# EAGLE design freq_meter_low (EAGLE 6.5.0)
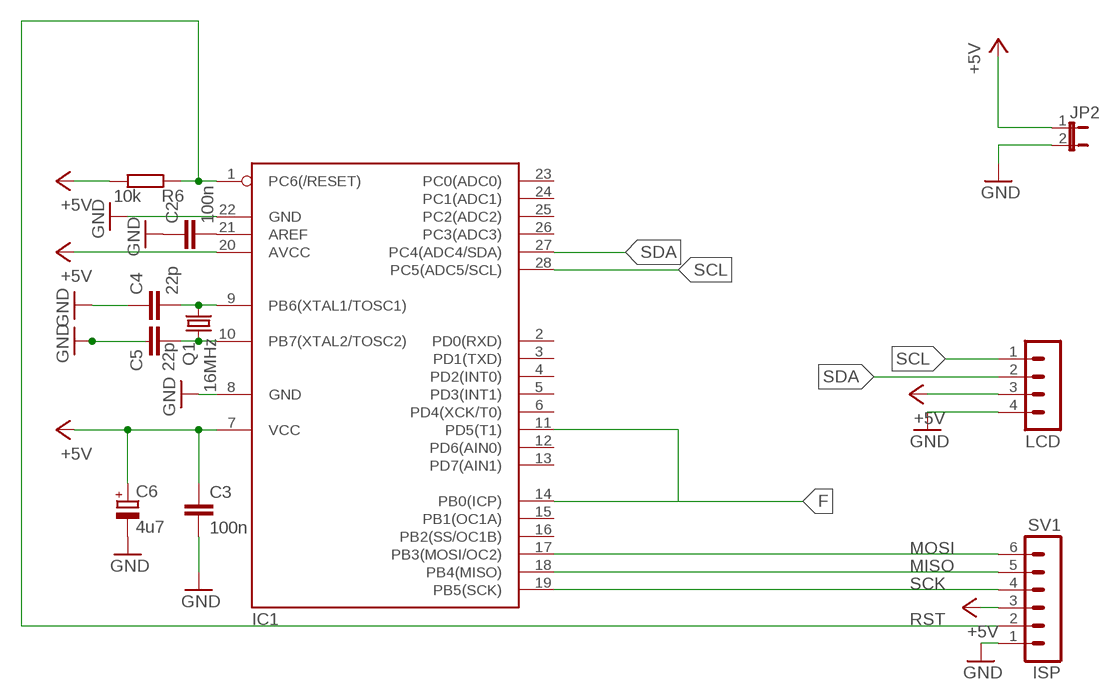
[diagram p0: schematic, sheet 1]

## Parts
C2  100n  C-EU025-024X044  [C025-024X044]
C3  100n  C-EU025-024X044  [C025-024X044]
C4  22p  C-EU025-024X044  [C025-024X044]
C5  22p  C-EU050-025X075  [C050-025X075]
C6  4u7  CPOL-EUTT2D5  [TT2D5]
IC1  MEGA8-P  [DIL28-3]
JP2  JP1E  [JP1]
LCD  MA04-1  [MA04-1]
Q1  16MHz  CRYSTALTC26V  [TC26V]
R6  10k  R-EU_0204/5  [0204/5]
SV1  ISP  MA06-1  [MA06-1]

## Nets
+5V: C3.1 C6.+ IC1.7(VCC) IC1.20(AVCC) JP2.1 LCD.3 R6.1 SV1.3
F: IC1.11(PD5(T1)) IC1.14(PB0(ICP))
GND: C2.1 C3.2 C4.1 C5.1 C6.- IC1.8(GND) IC1.22(GND) JP2.2 LCD.4 SV1.1
MISO: IC1.18(PB4(MISO)) SV1.5
MOSI: IC1.17(PB3(MOSI/OC2)) SV1.6
N$1: C2.2 IC1.21(AREF)
N$22: C4.2 IC1.9(PB6(XTAL1/TOSC1)) Q1.2
N$23: C5.2 IC1.10(PB7(XTAL2/TOSC2)) Q1.1
RST: IC1.1(PC6(/RESET)) R6.2 SV1.2
SCK: IC1.19(PB5(SCK)) SV1.4
SCL: IC1.28(PC5(ADC5/SCL)) LCD.1
SDA: IC1.27(PC4(ADC4/SDA)) LCD.2
Unconnected: IC1.2(PD0(RXD)) IC1.3(PD1(TXD)) IC1.4(PD2(INT0)) IC1.5(PD3(INT1)) IC1.6(PD4(XCK/T0)) IC1.12(PD6(AIN0)) IC1.13(PD7(AIN1)) IC1.15(PB1(OC1A)) IC1.16(PB2(SS/OC1B)) IC1.23(PC0(ADC0)) IC1.24(PC1(ADC1)) IC1.25(PC2(ADC2)) IC1.26(PC3(ADC3))

## Library data of the parts
C2-C5 = rcl:C-EU: CAPACITOR, European symbol
C6 = rcl:CPOL-EU: POLARIZED CAPACITOR, European symbol
IC1 = atmel:MEGA8-P: MICROCONTROLLER 8 Kbytes FLASH, 1 kbytes SRAM, 512 bytes EEPROM, USART, 4-channel 10 bit ADC, 2-channel 8 bit ADC Pin compatible with Atmega48, ATMega88, ATMega168 Source: avr.lbr
JP2 = jumper:JP1E: JUMPER
LCD = con-lstb:MA04-1: PIN HEADER; OC_FARNELL: unknown; OC_NEWARK: unknown
Q1 = crystal:CRYSTAL: CRYSTAL
R6 = rcl:R-EU_: RESISTOR, European symbol
SV1 = con-lstb:MA06-1: PIN HEADER; OC_FARNELL: unknown; OC_NEWARK: unknown

## Board
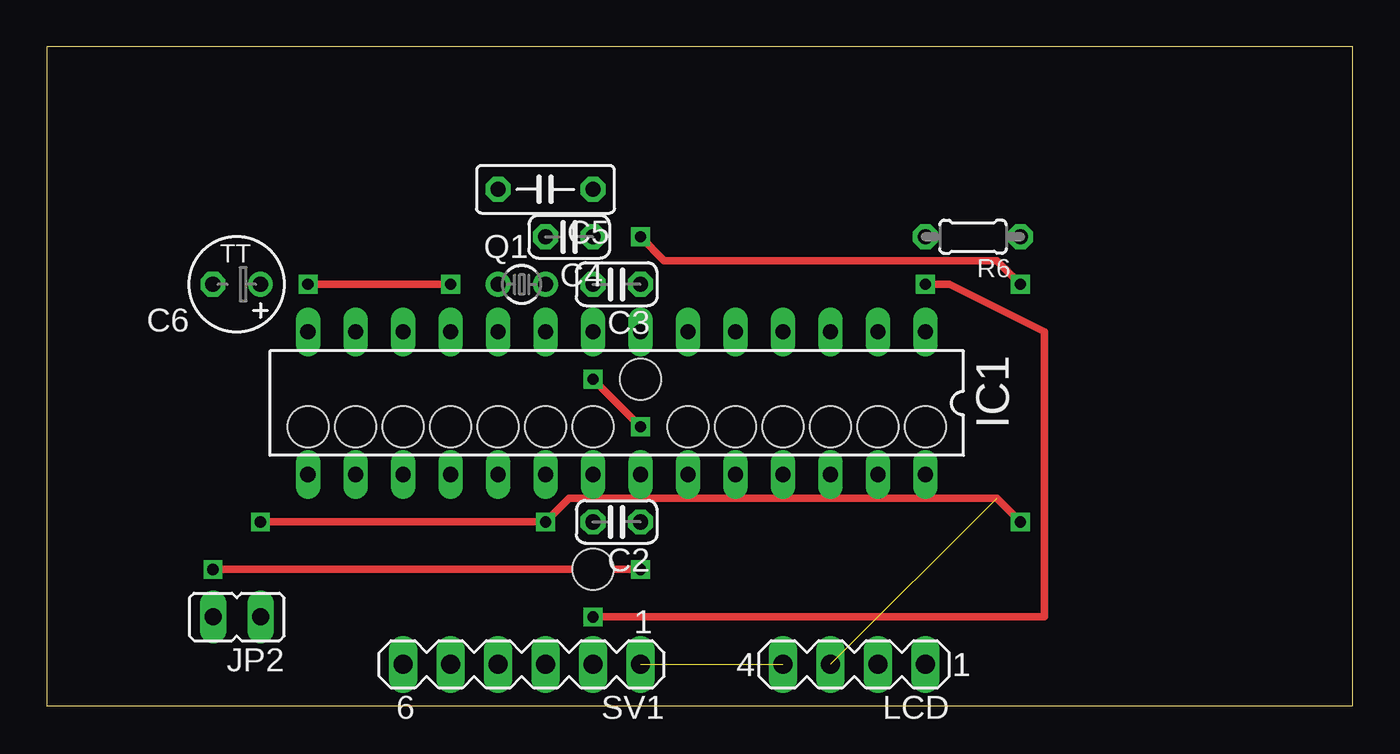
[diagram p1: board, top side]
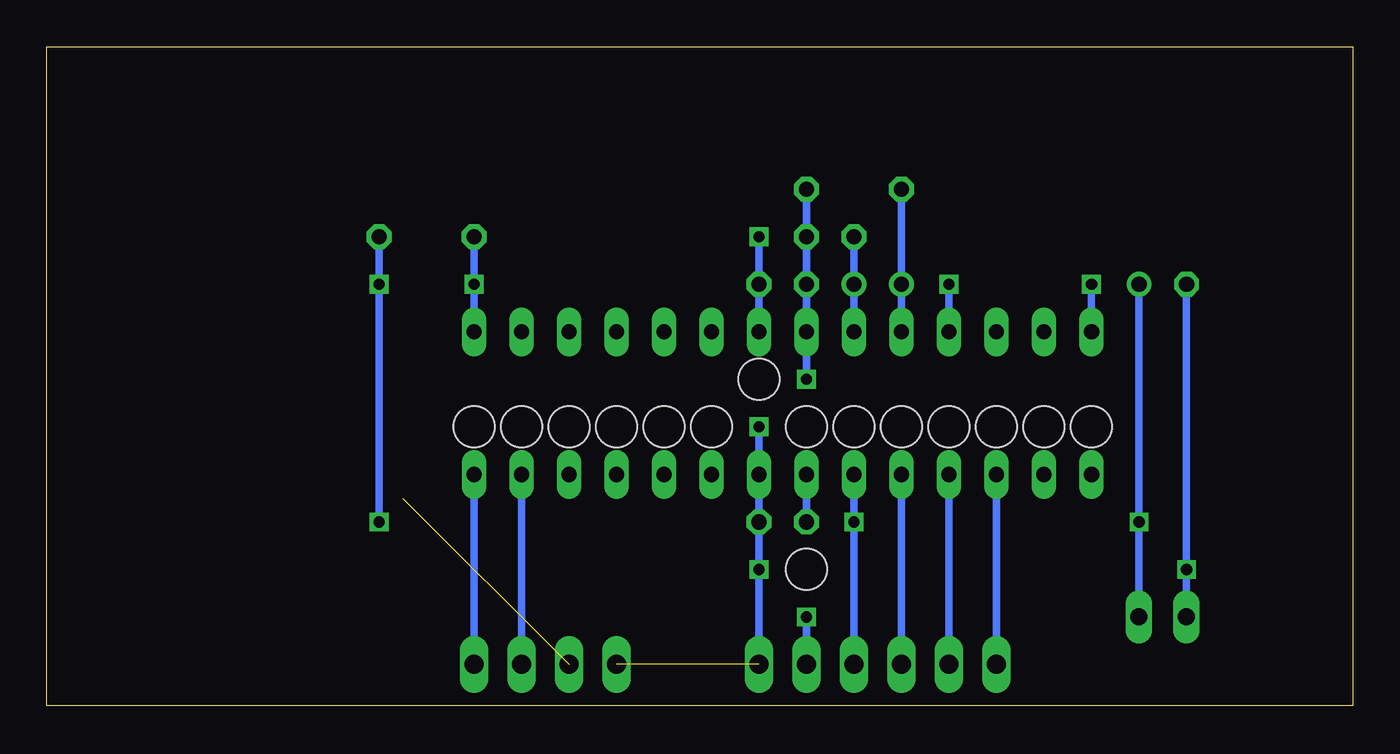
[diagram p2: board, bottom side, seen from below]

Size 69.84 x 35.23 mm. Coordinates in mm from the lower left corner, seen from the top.
Outline: 0,35.23 0,0 69.84,0 69.84,35.23 0,35.23
Copper layers (1*16): Top 0.035mm / dielectric 1.5mm / Bottom 0.035mm
Design rules "default": minimum track width 10mil, minimum drill 24mil, track to track 8mil, track to pad 8mil, pad to pad 8mil, via to via 8mil, smd to smd 8mil, copper to edge 40mil, drill to drill 8mil, minimum pad ring 10mil, minimum via ring 8mil, stop-mask expansion 4mil, vias tented up to drill 0mil, thermal gap 10mil
Holes 2.2 mm at 46.99,14.91 44.45,14.91 41.91,14.91 39.37,14.91 36.83,14.91 34.29,14.91 31.75,17.45 29.21,14.91 26.67,14.91 24.13,14.91 21.59,14.91 19.05,14.91 16.51,14.91 13.97,14.91 29.21,7.29

### Footprints (pad centres in the part's own frame; a part is rotated, then mirrored left to right if it is on the bottom)
C025-024X044 = drill 0.813 octagon: 1 -1.27,0; 2 1.27,0
C050-025X075 = drill 0.813 octagon: 1 -2.54,0; 2 2.54,0
TT2D5 = drill 0.813: + -1.27,0 | drill 0.813 octagon: - 1.27,0
DIL28-3 = drill 0.813 long: 1 -16.51,-3.81; 2 -13.97,-3.81; 3 -11.43,-3.81; 4 -8.89,-3.81; 5 -6.35,-3.81; 6 -3.81,-3.81; 7 -1.27,-3.81; 8 1.27,-3.81; 9 3.81,-3.81; 10 6.35,-3.81; 11 8.89,-3.81; 12 11.43,-3.81; 13 13.97,-3.81; 14 16.51,-3.81; 15 16.51,3.81; 16 13.97,3.81; 17 11.43,3.81; 18 8.89,3.81; 19 6.35,3.81; 20 3.81,3.81; 21 1.27,3.81; 22 -1.27,3.81; 23 -3.81,3.81; 24 -6.35,3.81; 25 -8.89,3.81; 26 -11.43,3.81; 27 -13.97,3.81; 28 -16.51,3.81
JP1 = drill 0.914 long: 1 0,-1.27; 2 0,1.27
MA04-1 = drill 1.016 long: 1 -3.81,0; 2 -1.27,0; 3 1.27,0; 4 3.81,0
TC26V = drill 0.813: 1 -1.27,0; 2 1.27,0
0204/5 = drill 0.813 octagon: 1 -2.54,0; 2 2.54,0
MA06-1 = drill 1.016 long: 1 -6.35,0; 2 -3.81,0; 3 -1.27,0; 4 1.27,0; 5 3.81,0; 6 6.35,0

### Placement (x,y rotation side)
C2  30.48,9.83 180 top
C3  30.48,22.53 180 top
C4  27.94,25.07 180 top
C5  26.67,27.61 180 top
C6  10.16,22.53 180 top
IC1  30.48,16.18 180 top
JP2  10.16,4.75 90 top
LCD  43.18,2.21 180 top
Q1  25.4,22.53 0 top
R6  49.53,25.07 180 top
SV1  25.4,2.21 180 top

### Tracks (layer width: path | path; a pad name or v marks a point on that pad's centre or on a via)
+5V  (via drill 0.6)  (1 unrouted)
  Top 0.406: v11.43,9.83 v26.67,9.83 27.94,11.1 50.8,11.1 v52.07,9.83 | v31.75,25.07 33.02,23.8 50.8,23.8 v52.07,22.53
  Bottom 0.406: IC1.7 C3.1 v31.75,25.07 | C6.+ v11.43,9.83 JP2.1 | SV1.3 v26.67,9.83 IC1.20 | v52.07,9.83 v52.07,22.53 R6.1
F  (via drill 0.6)
  Top 0.406: v21.59,22.53 v13.97,22.53
  Bottom 0.406: IC1.11 v21.59,22.53 | IC1.14 v13.97,22.53
GND  (via drill 0.6)  (1 unrouted)
  Top 0.406: v29.21,17.45 v31.75,14.91 | v31.75,7.29 v8.89,7.29
  Bottom 0.406: v31.75,14.91 IC1.22 C2.1 v31.75,7.29 SV1.1 | v29.21,17.45 IC1.8 C3.2 C5.1 C4.1 | C6.- v8.89,7.29 JP2.2
MISO
  Bottom 0.406: IC1.18 SV1.5
MOSI
  Bottom 0.406: SV1.6 IC1.17
N$1
  Bottom 0.406: IC1.21 C2.2
N$22
  Bottom 0.406: Q1.2 C4.2 IC1.9
N$23
  Bottom 0.406: IC1.10 C5.2 Q1.1
RST  (via drill 0.6)
  Top 0.406: v46.99,22.53 48.26,22.53 53.34,19.99 53.34,4.75 v29.21,4.75
  Bottom 0.406: SV1.2 v29.21,4.75 | IC1.1 v46.99,22.53 R6.2
SCK
  Bottom 0.406: SV1.4 IC1.19
SCL
  Bottom 0.406: IC1.28 LCD.1
SDA
  Bottom 0.406: IC1.27 LCD.2

### Text on the board
Document: MOSI | MISO | SCK